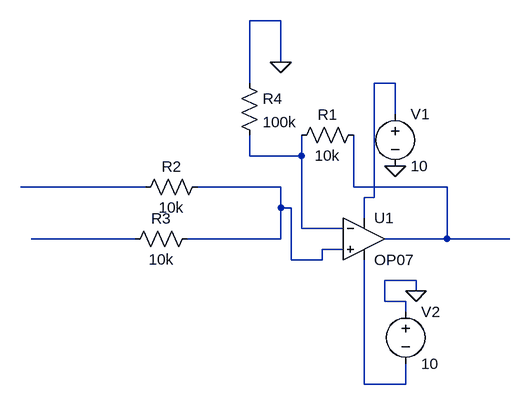
[diagram p0: schematic Draft1.asc]
Draft1.asc, the LTspice schematic file:
Version 4
SHEET 1 1080 680
WIRE 32 -464 -16 -464
WIRE 32 -400 32 -464
WIRE -16 -368 -16 -464
WIRE 208 -368 176 -368
WIRE 208 -320 208 -368
WIRE -16 -256 -16 -288
WIRE 64 -256 64 -288
WIRE 64 -256 -16 -256
WIRE -176 -208 -368 -208
WIRE 32 -208 -96 -208
WIRE 144 -208 144 -288
WIRE 288 -208 144 -208
WIRE 176 -192 176 -368
WIRE 176 -192 160 -192
WIRE 32 -176 32 -208
WIRE 48 -176 32 -176
WIRE 160 -160 160 -192
WIRE 64 -144 64 -256
WIRE 128 -144 64 -144
WIRE -192 -128 -352 -128
WIRE 32 -128 32 -176
WIRE 32 -128 -112 -128
WIRE 288 -128 288 -208
WIRE 288 -128 192 -128
WIRE 384 -128 288 -128
WIRE 128 -112 96 -112
WIRE 48 -96 48 -176
WIRE 96 -96 96 -112
WIRE 96 -96 48 -96
WIRE 240 -64 192 -64
WIRE 240 -48 240 -64
WIRE 192 -32 192 -64
WIRE 224 -32 192 -32
WIRE 224 -16 224 -32
WIRE 160 96 160 -96
WIRE 224 96 224 64
WIRE 224 96 160 96
FLAG 208 -240 0
FLAG 240 -48 0
FLAG 32 -400 0
SYMBOL OpAmps\\OP07 160 -192 R0
SYMATTR InstName U1
SYMBOL voltage 208 -336 R0
SYMATTR InstName V1
SYMATTR Value 10
SYMBOL voltage 224 -32 R0
SYMATTR InstName V2
SYMATTR Value 10
SYMBOL res 160 -304 R90
WINDOW 0 0 56 VBottom 2
WINDOW 3 32 56 VTop 2
SYMATTR InstName R1
SYMATTR Value 10k
SYMBOL res -80 -224 R90
WINDOW 0 0 56 VBottom 2
WINDOW 3 32 56 VTop 2
SYMATTR InstName R2
SYMATTR Value 10k
SYMBOL res -96 -144 R90
WINDOW 0 0 56 VBottom 2
WINDOW 3 32 56 VTop 2
SYMATTR InstName R3
SYMATTR Value 10k
SYMBOL res -32 -384 R0
SYMATTR InstName R4
SYMATTR Value 100k

The netlist it stands for:
* Draft1.asc
XU1 N004 N002 N001 N007 N005 LT1001  ; OP07, pins In+ In- V+ V- OUT
V1 N001 0 10
V2 0 N007 10
R1 N005 N002 10k
R2 N004 N003 10k
R3 N004 N006 10k
R4 0 N002 100k
.lib LTC.lib
.backanno
.end